# EAGLE design IN-17 tubes V1.1 (EAGLE 9.6.2)
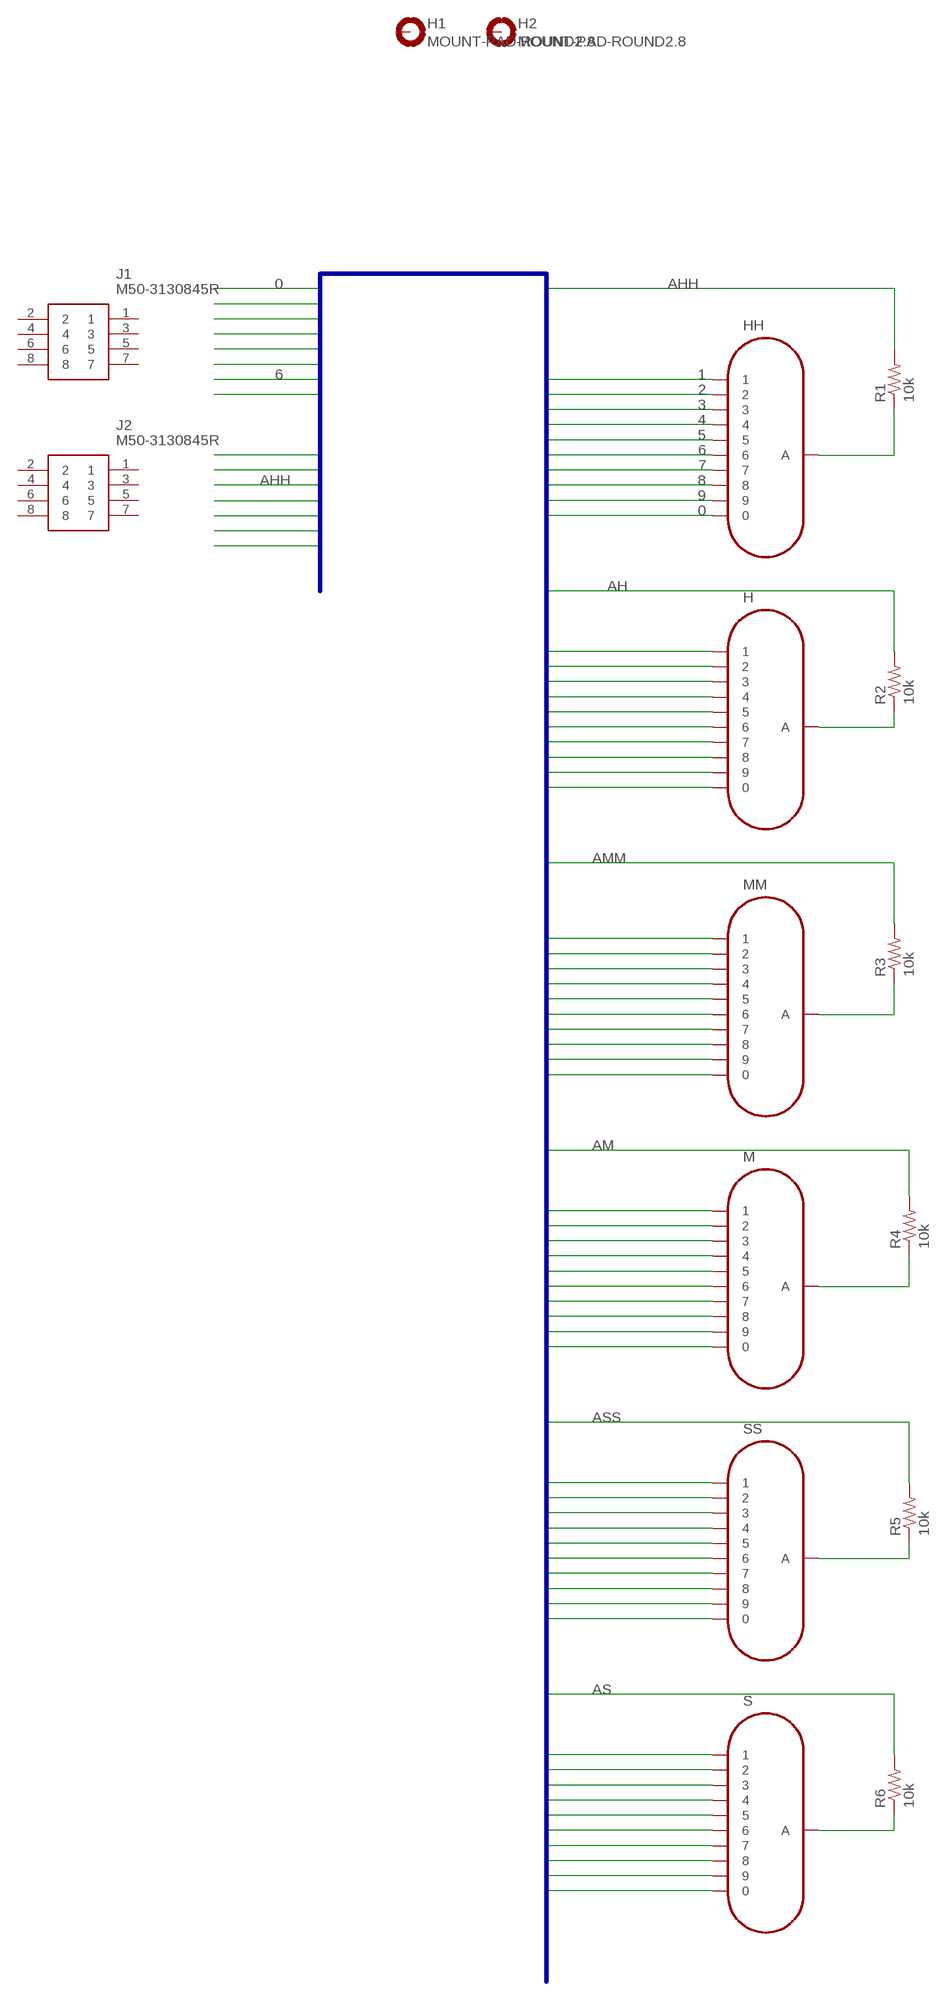
[diagram p0: schematic, sheet 1]

## Parts
H  IN-17  [IN-17]
H1  MOUNT-PAD-ROUND2.8  [2,8-PAD]
H2  MOUNT-PAD-ROUND2.8  [2,8-PAD]
HH  IN-17  [IN-17]
J1  M50-3130845R  [M503130845R]
J2  M50-3130845R  [M503130845R]
M  IN-17  [IN-17]
MM  IN-17  [IN-17]
R1  10k  R-US_R0805  [R0805]
R2  10k  R-US_R0805  [R0805]
R3  10k  R-US_R0805  [R0805]
R4  10k  R-US_R0805  [R0805]
R5  10k  R-US_R0805  [R0805]
R6  10k  R-US_R0805  [R0805]
S  IN-17  [IN-17]
SS  IN-17  [IN-17]

## Nets
0: H.0 HH.0 M.0 MM.0 S.0 SS.0
1: H.1 HH.1 M.1 MM.1 S.1 SS.1
2: H.2 HH.2 M.2 MM.2 S.2 SS.2
3: H.3 HH.3 M.3 MM.3 S.3 SS.3
4: H.4 HH.4 M.4 MM.4 S.4 SS.4
5: H.5 HH.5 M.5 MM.5 S.5 SS.5
6: H.6 HH.6 M.6 MM.6 S.6 SS.6
7: H.7 HH.7 M.7 MM.7 S.7 SS.7
8: H.8 HH.8 M.8 MM.8 S.8 SS.8
9: H.9 HH.9 M.9 MM.9 S.9 SS.9
AH: R2.2
AHH: R1.2
AM: R4.2
AMM: R3.2
AS: R6.2
ASS: R5.2
N$1: HH.A R1.1
N$3: R6.1 S.A
N$4: R5.1 SS.A
N$5: M.A R4.1
N$6: MM.A R3.1
N$7: H.A R2.1
Unconnected: H1.B2,8(MOUNT) H2.B2,8(MOUNT) J1.1 J1.2 J1.3 J1.4 J1.5 J1.6 J1.7 J1.8 J2.1 J2.2 J2.3 J2.4 J2.5 J2.6 J2.7 J2.8

## Buses
0,1,2,3,4,5,6,7,8,9,AH,AHH,AM,AMM,AS,ASS

## Library data of the parts
H HH M MM S SS = russian-nixies:IN-17: IN-17: tiny numeric topview nixie tube
H1 H2 = holes:MOUNT-PAD-ROUND: MOUNTING PAD, round
J1 J2 = SamacSys_Parts:M50-3130845R: Headers & Wire Housings 8 WAY SIL L/P D/E SMT SKT T&R Source: Datasheet <https://cdn.harwin.com/pdfs/M50-313.pdf>; DESCRIPTION: Headers & Wire Housings 8 WAY SIL L/P D/E SMT SKT T&R; HEIGHT: 2.15mm; MANUFACTURER_NAME: Harwin; MANUFACTURER_PART_NUMBER: M50-3130845R; MOUSER_PART_NUMBER: 855-M50-3130845R; MOUSER_PRICE-STOCK: https://www.mouser.co.uk/ProductDetail/Harwin/M50-3130845R?qs=%252BdQmOuGyFcEPvrxbacvJZw%3D%3D
R1-R6 = adafruit:R-US_: RESISTOR, American symbol

## Board
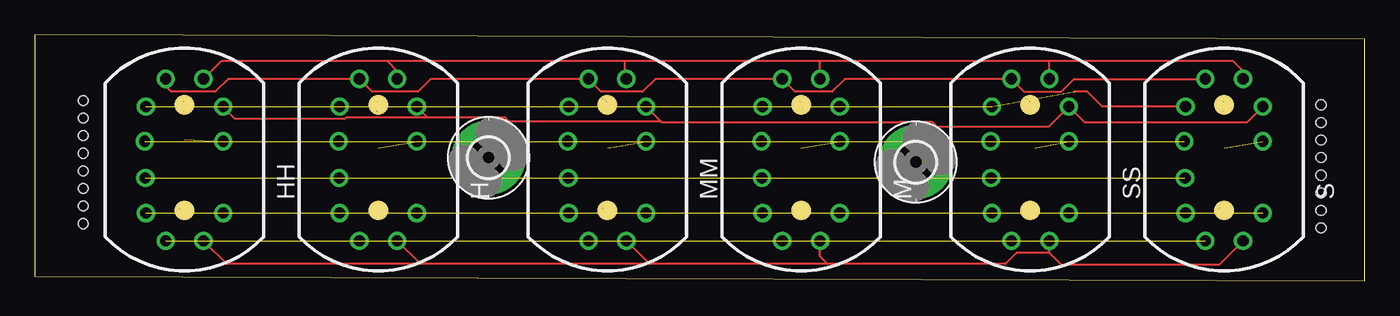
[diagram p1: board, top side]
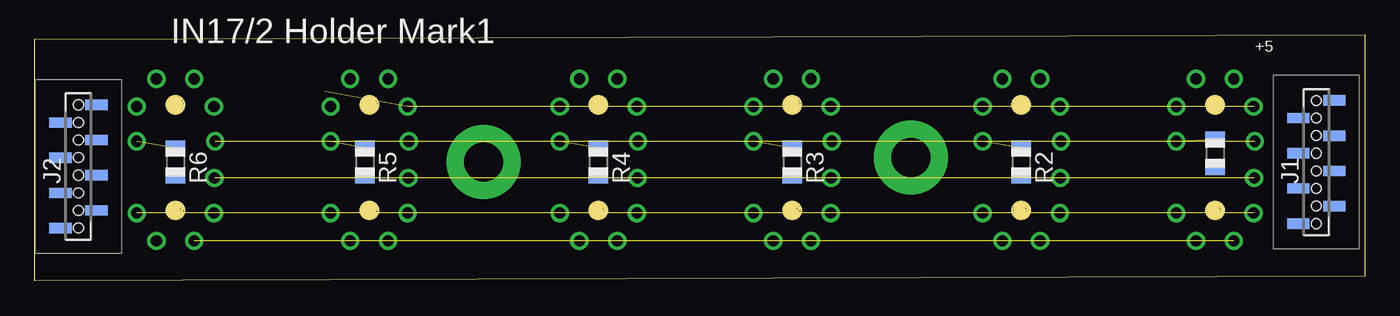
[diagram p2: board, bottom side, seen from below]

Size 95.87 x 17.77 mm. Coordinates in mm from the lower left corner, seen from the top.
Outline: 0,0.32 95.87,0 95.87,17.45 0,17.77 0,0.32
Copper layers (1*16): Top 0.035mm / dielectric 1.5mm / Bottom 0.035mm
Design rules "default": minimum track width 6mil, minimum drill 0.35mm, track to track 6mil, track to pad 6mil, pad to pad 6mil, via to via 6mil, smd to smd 6mil, copper to edge 40mil, drill to drill 6mil, minimum pad ring 10mil, minimum via ring 8mil, stop-mask expansion 4mil, vias tented up to drill 0mil, thermal gap 10mil

### Footprints (pad centres in the part's own frame; a part is rotated, then mirrored left to right if it is on the bottom)
IN-17 = drill 0.8: 0 2.777,4; 1 1.365,6; 2 -1.365,6; 3 -2.778,4; 4 -2.858,1.5; 5 -2.818,-1.143; 6 -2.778,-3.683; 7 -1.365,-5.683; 8 1.365,-5.683; 9 2.777,-3.683; A 2.777,1.5
2,8-PAD = drill 2.8 pad 5.334: B2,8 0,0
M503130845R = smd 0.74 x 1.6: 1 -4.445,1.3; 2 -3.175,-1.3; 3 -1.905,1.3; 4 -0.635,-1.3; 5 0.635,1.3; 6 1.905,-1.3; 7 3.175,1.3; 8 4.445,-1.3 | hole 0.7: -4.445,0; -3.175,0; -1.905,0; -0.635,0; 0.635,0; 1.905,0; 3.175,0; 4.445,0
R0805 = smd 1.1 x 1.4: 1 -1,0; 2 1,0

### Placement (x,y rotation side)
H  24.76,8.57 0 top
H1  32.7,8.89 0 top
H2  63.5,8.57 0 top
HH  10.8,8.57 0 top
J1  3.49,8.57 90 bottom
J2  92.71,8.26 90 bottom
M  55.25,8.57 0 top
MM  41.28,8.57 0 top
R1  10.8,9.21 270 bottom
R2  24.76,8.57 270 bottom
R3  41.28,8.57 270 bottom
R4  55.25,8.57 270 bottom
R5  72.07,8.57 270 bottom
R6  85.73,8.57 270 bottom
S  85.73,8.57 0 top
SS  71.76,8.57 0 top

### Tracks (layer width: path | path; a pad name or v marks a point on that pad's centre or on a via)
0  (1 unrouted)
  Top 0.152: S.0 87.36,11.43 75.67,11.43 SS.0 73.07,11.11 65.06,11.11 64.7,11.47 62.3,11.47 62.26,11.43 45.2,11.43 45.14,11.48 | 45.14,11.48 MM.0 | 45.14,11.48 34.2,11.48 33.9,11.79 28.57,11.79 28.33,11.79 | 28.33,11.79 H.0 | 28.33,11.79 22.45,11.79 22.35,11.69 14.46,11.69 HH.0
1
  Top 0.152: HH.1 13.46,15.87 25.4,15.87 | 25.4,15.87 26.13,15.15 H.1 | 25.4,15.87 42.55,15.87 | 42.55,15.87 56.52,15.87 | 56.52,15.87 73.03,15.87 | 73.03,15.87 86.36,15.87 87.09,15.15 S.1 | MM.1 42.55,14.67 42.55,15.87 | M.1 56.61,15.78 56.52,15.87 | SS.1 73.12,15.78 73.03,15.87
2
  Top 0.152: HH.2 9.43,14.07 9.84,13.65 13.02,13.65 13.94,14.57 H.2 24.32,13.65 27.62,13.65 28.54,14.57 MM.2 40.83,13.65 43.81,13.65 44.73,14.57 M.2 54.8,13.65 57.47,13.65 58.39,14.57 SS.2 71.31,13.65 73.98,13.65 74.9,14.57 S.2
3  (5 unrouted)
  Top 0.152: S.3 76.96,12.57 75.88,13.65 74.93,13.65
4  (5 unrouted)
5  (5 unrouted)
6  (5 unrouted)
7  (5 unrouted)
8
  Top 0.152: S.8 85.37,1.16 73.98,1.16 73.13,2.01 | 73.13,2.01 73.12,2.02 SS.8 | 73.13,2.01 70.76,2.01 69.97,1.22 57.15,1.22 | 57.15,1.22 56.61,1.76 M.8 | 57.15,1.22 44.31,1.22 | 44.31,1.22 MM.8 | 44.31,1.22 27.8,1.22 | H.8 27.8,1.22 | 27.8,1.22 13.83,1.22 HH.8
9  (5 unrouted)
N$1  (1 unrouted)
N$3  (1 unrouted)
N$4  (1 unrouted)
N$5  (1 unrouted)
N$6  (1 unrouted)
N$7  (1 unrouted)

### Text on the board
tNames: Front
bNames: SteamClock | IN17/2 Holder Mark1 | +5